# EAGLE schematic TPS62730 (EAGLE 7.5.0)
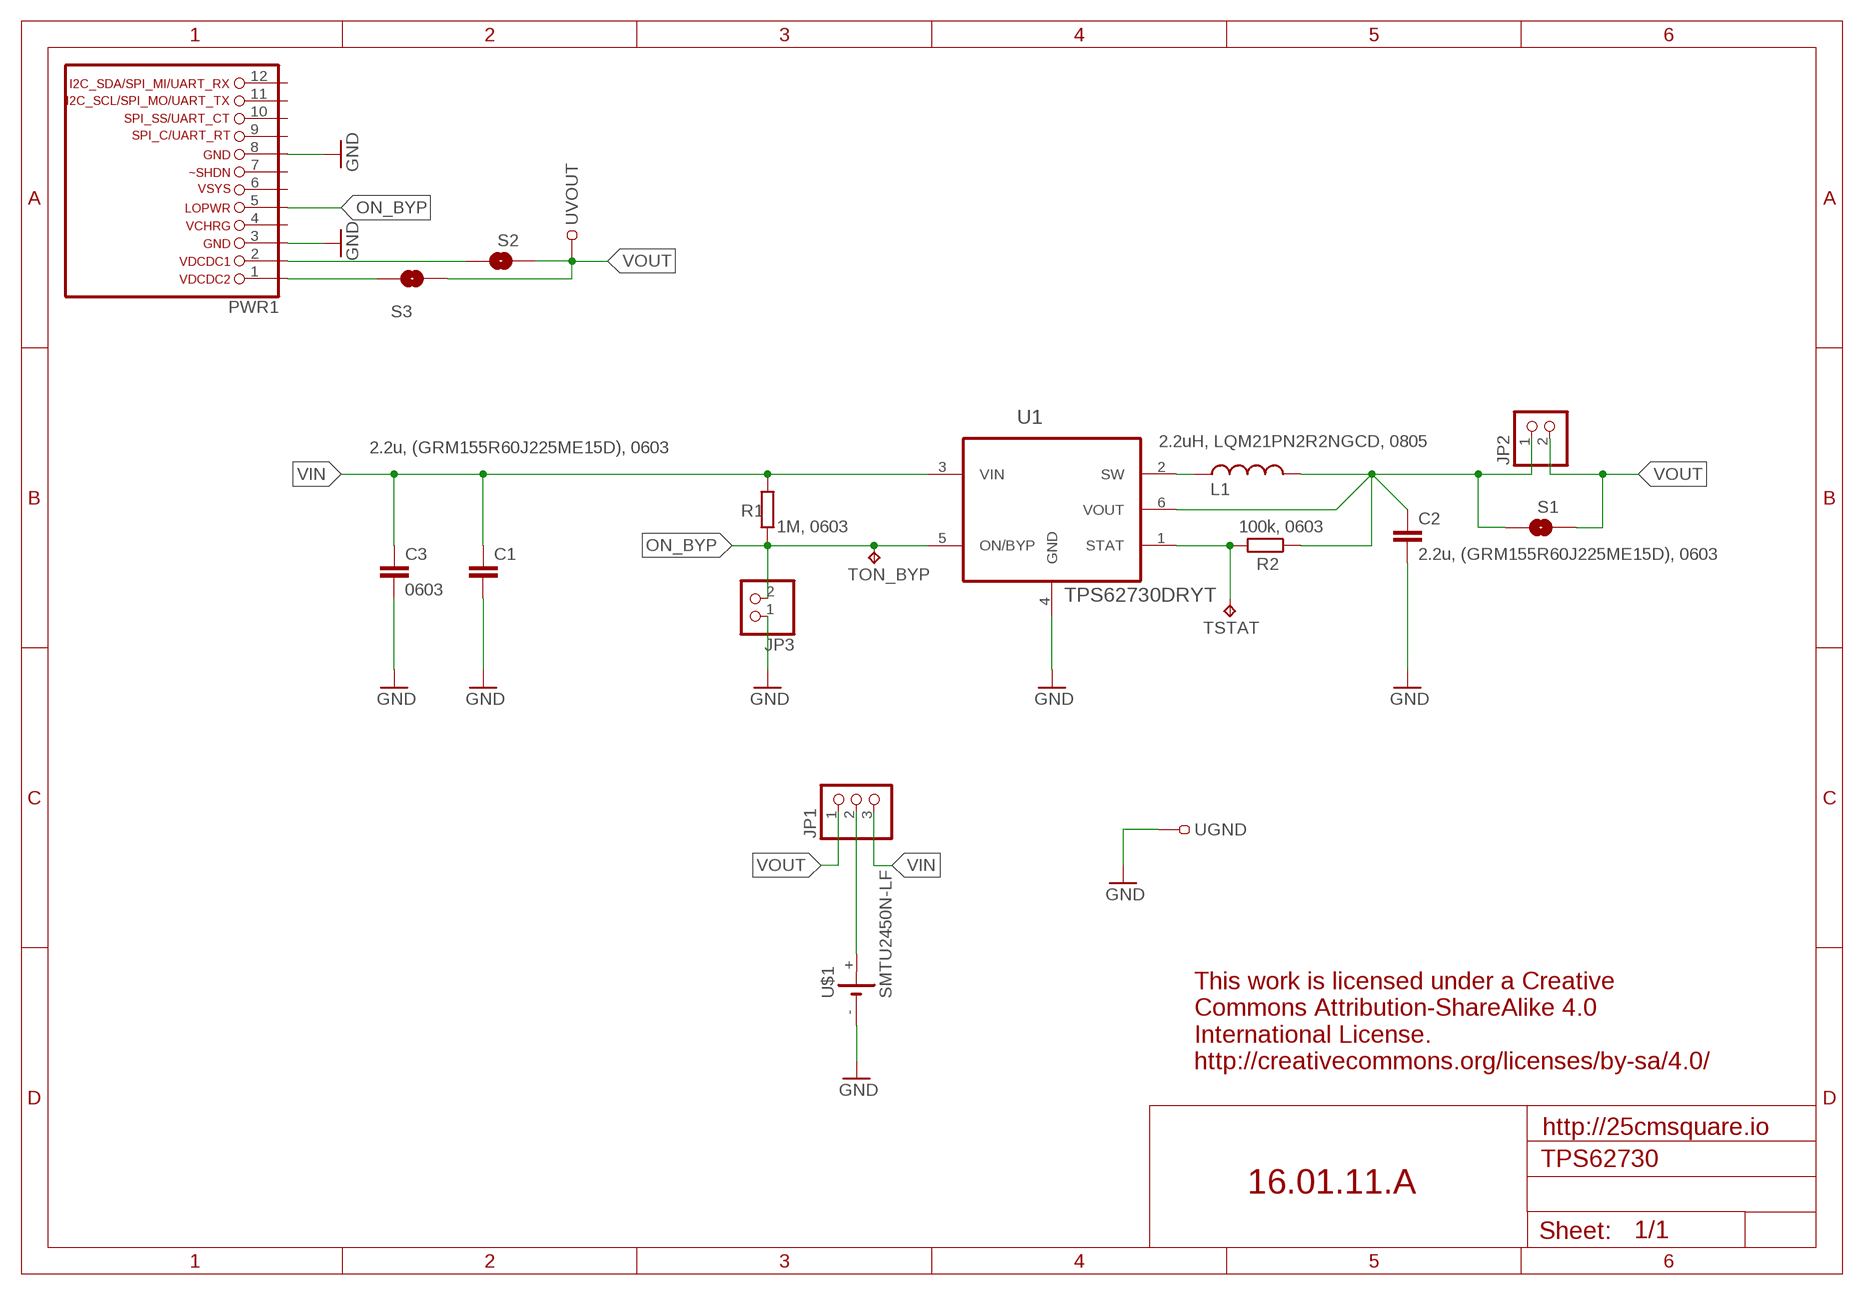
[diagram p0: schematic, sheet 1]

## Parts
C1  2.2u, (GRM155R60J225ME15D), 0603  C-EUC0603K  [C0603K]
C2  2.2u, (GRM155R60J225ME15D), 0603  C-EUC0603K  [C0603K]
C3  0603  C-EUC0603K  [C0603K]
JP1  PINHD-1X3  [1X03]
JP2  PINHD-1X2  [1X02]
JP3  PINHD-1X2  [1X02]
L1  2.2uH, LQM21PN2R2NGCD, 0805  L0805(2012)  [L0805]
PWR1  LIWE_12_PIN_PWR  [LIWE_12_PIN]
R1  1M, 0603  R-EU_R0603  [R0603]
R2  100k, 0603  R-EU_R0603  [R0603]
S1  SOLDERJUMPERNC2  [SJ_2S-NOTRACE]
S2  SOLDERJUMPERNC2  [SJ_2S-NOTRACE]
S3  SOLDERJUMPERNC2  [SJ_2S-NOTRACE]
TON_BYP  TPTP14R  [TP14R]
TSTAT  TPTP14R  [TP14R]
U1  TPS62730DRYT  [SON50P100X145X60-6N]
U$1  SMTU2450N-LF  [SMTU2450N-LF]
UGND  TEST-22-MULTICOMP  [TEST_1MM]
UVOUT  TEST-22-MULTICOMP  [TEST_1MM]

## Nets
GND: C1.2 C2.2 C3.2 JP3.1 PWR1.3 PWR1.8 U1.4(GND) U$1.- UGND.1
N$1: JP1.2 U$1.+
N$4: PWR1.2 S2.1
N$5: R2.2 TSTAT.TP U1.1(STAT)
N$6: PWR1.1 S3.1
ON_BYP: JP3.2 PWR1.5 R1.1 TON_BYP.TP U1.5(ON/BYP)
SW: L1.1 U1.2(SW)
VIN: C1.1 C3.1 JP1.3 R1.2 U1.3(VIN)
VL1: C2.1 JP2.1 L1.2 R2.1 S1.1 U1.6(VOUT)
VOUT: JP1.1 JP2.2 S1.2 S2.2 S3.2 UVOUT.1
Unconnected: PWR1.4 PWR1.6 PWR1.7 PWR1.9 PWR1.10 PWR1.11 PWR1.12

## Notes on the sheet
- This work is licensed under a Creative
  Commons Attribution-ShareAlike 4.0
  International License.
  http://creativecommons.org/licenses/by-sa/4.0/
- http://25cmsquare.io
- 16.01.11.A

## Library data of the parts
C1-C3 = rcl:C-EU: CAPACITOR, European symbol
JP1 = pinhead:PINHD-1X3: PIN HEADER
JP2 JP3 = pinhead:PINHD-1X2: PIN HEADER
L1 = pma:L
PWR1 = pma:LIWE_12_PIN_PWR
R1 R2 = resistor:R-EU_: RESISTOR, European symbol
S1-S3 = SparkFun-Passives:SOLDERJUMPER: Solder Jumper Standard SMD solder jumper. Used to automate production. Two varients : Normally Open and Normally Closed are the same, but have different paste layers. NC will have a large amount of paste and should jumper during reflow.
TON_BYP TSTAT = testpad:TP: Test pad
U1 = TI-TPS62730DRYT:TPS62730DRYT: Step Down Converter,SON-6; MPN: TPS62730DRYT; OC_FARNELL: 1961827; OC_NEWARK: 52T8814; PACKAGE: SON-6; SUPPLIER: TEXAS INSTRUMENTS
U$1 = pma:SMTU2450N-LF: SMTU2450N-LF http://sk.farnell.com/renata/smtu-2450n-1-lf/holder-smd-battery-for-cr-2450/dp/1216356
UGND UVOUT = pma:TEST-22-MULTICOMP: MULTICOMP TEST-22 TEST PIN, PCB, 1.0MM FARNELL: 1702010